# EAGLE design party-games-receiver (EAGLE 7.7.0)
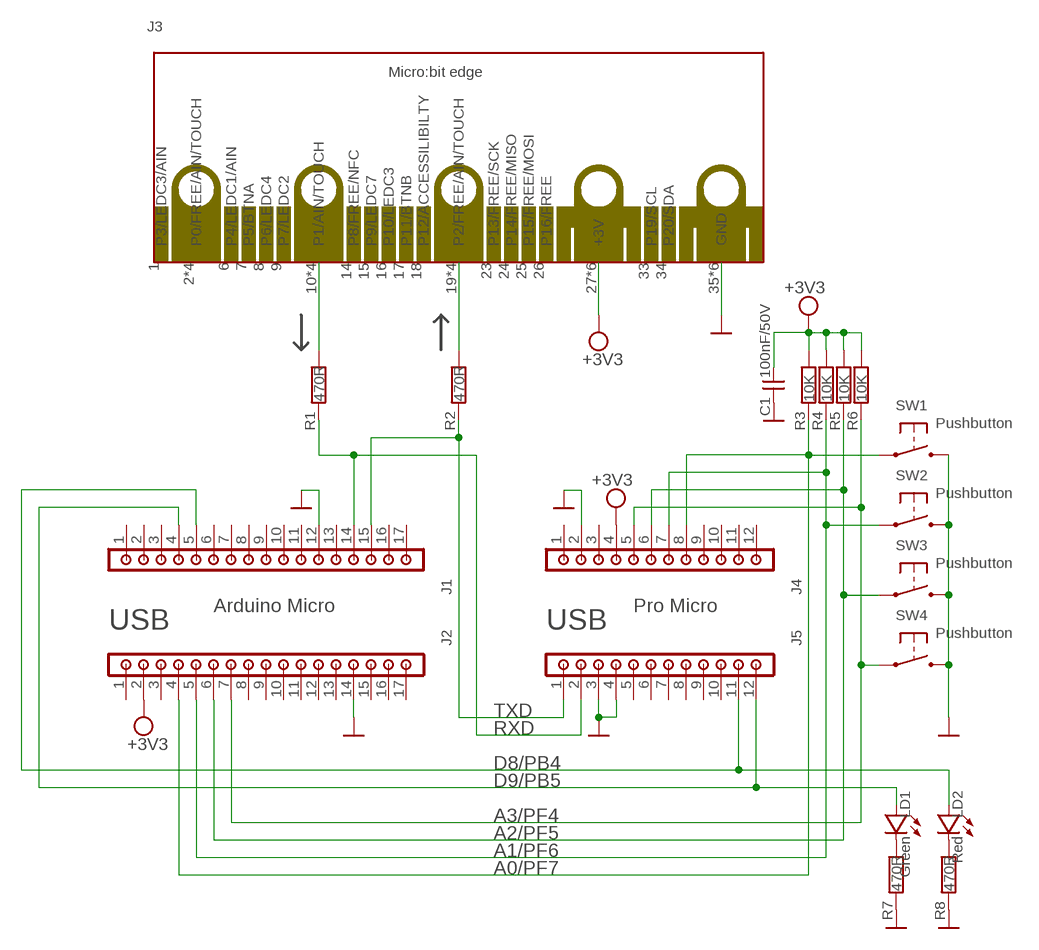
[diagram p0: schematic, sheet 1]

## Parts
C1  CC100NA  [CAP_0805]
J1  CJHDR1X17MA  [CON_HDR_M_1X17]
J2  CJHDR1X17MA  [CON_HDR_M_1X17]
J3  CJMBITH  [SOCKET_MBIT_H]
J4  CJHDR1X12MA  [CON_HDR_M_1X12]
J5  CJHDR1X12MA  [CON_HDR_M_1X12]
LD1  CDLEDGNC  [LED_0805]
LD2  CDLEDRDC  [LED_0805]
R1  CR470RA  [RES_0805]
R2  CR470RA  [RES_0805]
R3  CR10KA  [RES_0805]
R4  CR10KA  [RES_0805]
R5  CR10KA  [RES_0805]
R6  CR10KA  [RES_0805]
R7  CR470RA  [RES_0805]
R8  CR470RA  [RES_0805]
SW1  CSWPUSHA  [SWITCH_PUSH_5MM]
SW2  CSWPUSHA  [SWITCH_PUSH_5MM]
SW3  CSWPUSHA  [SWITCH_PUSH_5MM]
SW4  CSWPUSHA  [SWITCH_PUSH_5MM]

## Nets
+3V3: C1.2 J2.2 J3.27(+3V) J3.28(+3V) J3.29(+3V) J3.30(+3V) J3.31(+3V) J3.32(+3V) J4.4 R3.2 R4.2 R5.2 R6.2 ; supply symbol labelled SUPPLY_+3V3
A0/PF7: J2.4 J4.8 R3.1 SW1.3(P) SW1.4(P)
A1/PF6: J2.5 J4.7 R4.1 SW2.3(P) SW2.4(P)
A2/PF5: J2.6 J4.6 R5.1 SW3.3(P) SW3.4(P)
A3/PF4: J2.7 J4.5 R6.1 SW4.3(P) SW4.4(P)
D8/PB4: J1.5 J5.11 LD2.A
D9/PB5: J1.4 J5.12 LD1.A
GND: C1.1 J1.12 J2.14 J3.35(GND) J3.36(GND) J3.37(GND) J3.38(GND) J3.39(GND) J3.40(GND) J4.2 J5.3 J5.4 R7.1 R8.1 SW1.1(S) SW1.2(S) SW2.1(S) SW2.2(S) SW3.1(S) SW3.2(S) SW4.1(S) SW4.2(S)
N$1: LD1.C R7.2
N$2: J3.10(P1/AIN/TOUCH) J3.11(P1/AIN/TOUCH) J3.12(P1/AIN/TOUCH) J3.13(P1/AIN/TOUCH) R1.2
N$3: J3.19(P2/FREE/AIN/TOUCH) J3.20(P2/FREE/AIN/TOUCH) J3.21(P2/FREE/AIN/TOUCH) J3.22(P2/FREE/AIN/TOUCH) R2.2
N$4: LD2.C R8.2
RXD: J1.14 J5.2 R1.1
TXD: J1.15 J5.1 R2.1
Unconnected: J1.1 J1.2 J1.3 J1.6 J1.7 J1.8 J1.9 J1.10 J1.11 J1.13 J1.16 J1.17 J2.1 J2.3 J2.8 J2.9 J2.10 J2.11 J2.12 J2.13 J2.15 J2.16 J2.17 J3.1(P3/LEDC3/AIN) J3.2(P0/FREE/AIN/TOUCH) J3.3(P0/FREE/AIN/TOUCH) J3.4(P0/FREE/AIN/TOUCH) J3.5(P0/FREE/AIN/TOUCH) J3.6(P4/LEDC1/AIN) J3.7(P5/BTNA) J3.8(P6/LEDC4) J3.9(P7/LEDC2) J3.14(P8/FREE/NFC) J3.15(P9/LEDC7) J3.16(P10/LEDC3) J3.17(P11/BTNB) J3.18(P12/ACCESSILIBILTY) J3.23(P13/FREE/SCK) J3.24(P14/FREE/MISO) J3.25(P15/FREE/MOSI) J3.26(P16/FREE) J3.33(P19/SCL) J3.34(P20/SDA) J4.1 J4.3 J4.9 J4.10 J4.11 J4.12 J5.5 J5.6 J5.7 J5.8 J5.9 J5.10

## Notes on the sheet
- Arduino Micro | Pro Micro
- USB | USB

## Library data of the parts
C1 = d2s_new:CC100NA: Capacitor ceramic 100nF / 50V / SMD 0805 / X7R Estimated price: 0.006000 EUR; ESTIMATED_PRICE: 0.006000; SUPPLIER_1: Farnell; SUPPLIER_1_REF: 1759265; VALUE_SHOWN: 100nF/50V
J1 J2 = d2s_new:CJHDR1X17MA
J3 = d2s_new:CJMBITH: Micro:bit edge connectie Estimated price: 0.000000 EUR; ESTIMATED_PRICE: 0.000000; VALUE_SHOWN: Micro:bit edge
J4 J5 = d2s_new:CJHDR1X12MA
LD1 = d2s_new:CDLEDGNC: Led Green 568nm / 120 deg / 20mA / 2,2V / SMD 0805 Estimated price: 0.080000 EUR; ESTIMATED_PRICE: 0.080000; SUPPLIER_1: Farnell; SUPPLIER_1_REF: 2099239; VALUE_SHOWN: Green
LD2 = d2s_new:CDLEDRDC: Led Red 625nm / 120 deg / 20mA / 2V / SMD 0805 Estimated price: 0.017800 EUR; ESTIMATED_PRICE: 0.017800; SUPPLIER_1: Farnell; SUPPLIER_1_REF: 2099236; VALUE_SHOWN: Red
R1 R2 R7 R8 = d2s_new:CR470RA: 470R / 1% / 0,1W / 0805 Estimated price: 0.001400 EUR; ESTIMATED_PRICE: 0.001400; SUPPLIER_1: Farnell; SUPPLIER_1_REF: 9333258; VALUE_SHOWN: 470R
R3-R6 = d2s_new:CR10KA: 10K / 1% / 0,1W / 0805 Estimated price: 0.001300 EUR; ESTIMATED_PRICE: 0.001300; SUPPLIER_1: Farnell; SUPPLIER_1_REF: 9332391; VALUE_SHOWN: 10K
SW1-SW4 = d2s_new:CSWPUSHA: drukknop (on)-off 6x6mm print height 4mm Estimated price: 0.268000 EUR; ESTIMATED_PRICE: 0.268000; SUPPLIER_1: Vael; SUPPLIER_1_REF: 760.41606.5; VALUE_SHOWN: Pushbutton

## Board
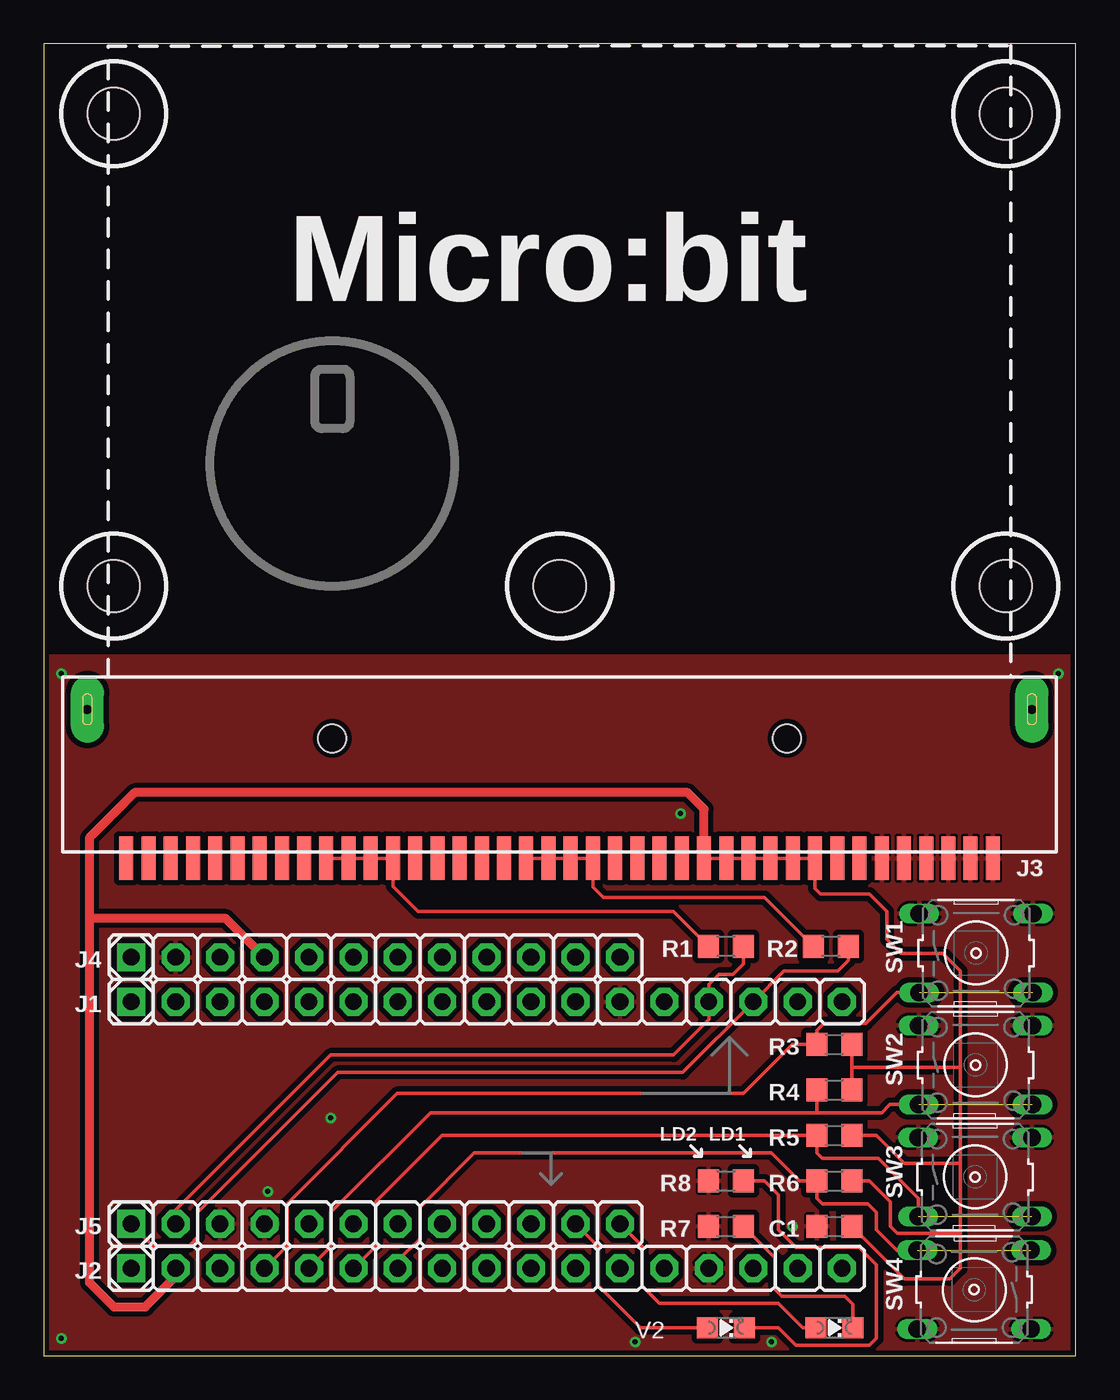
[diagram p1: board, top side]
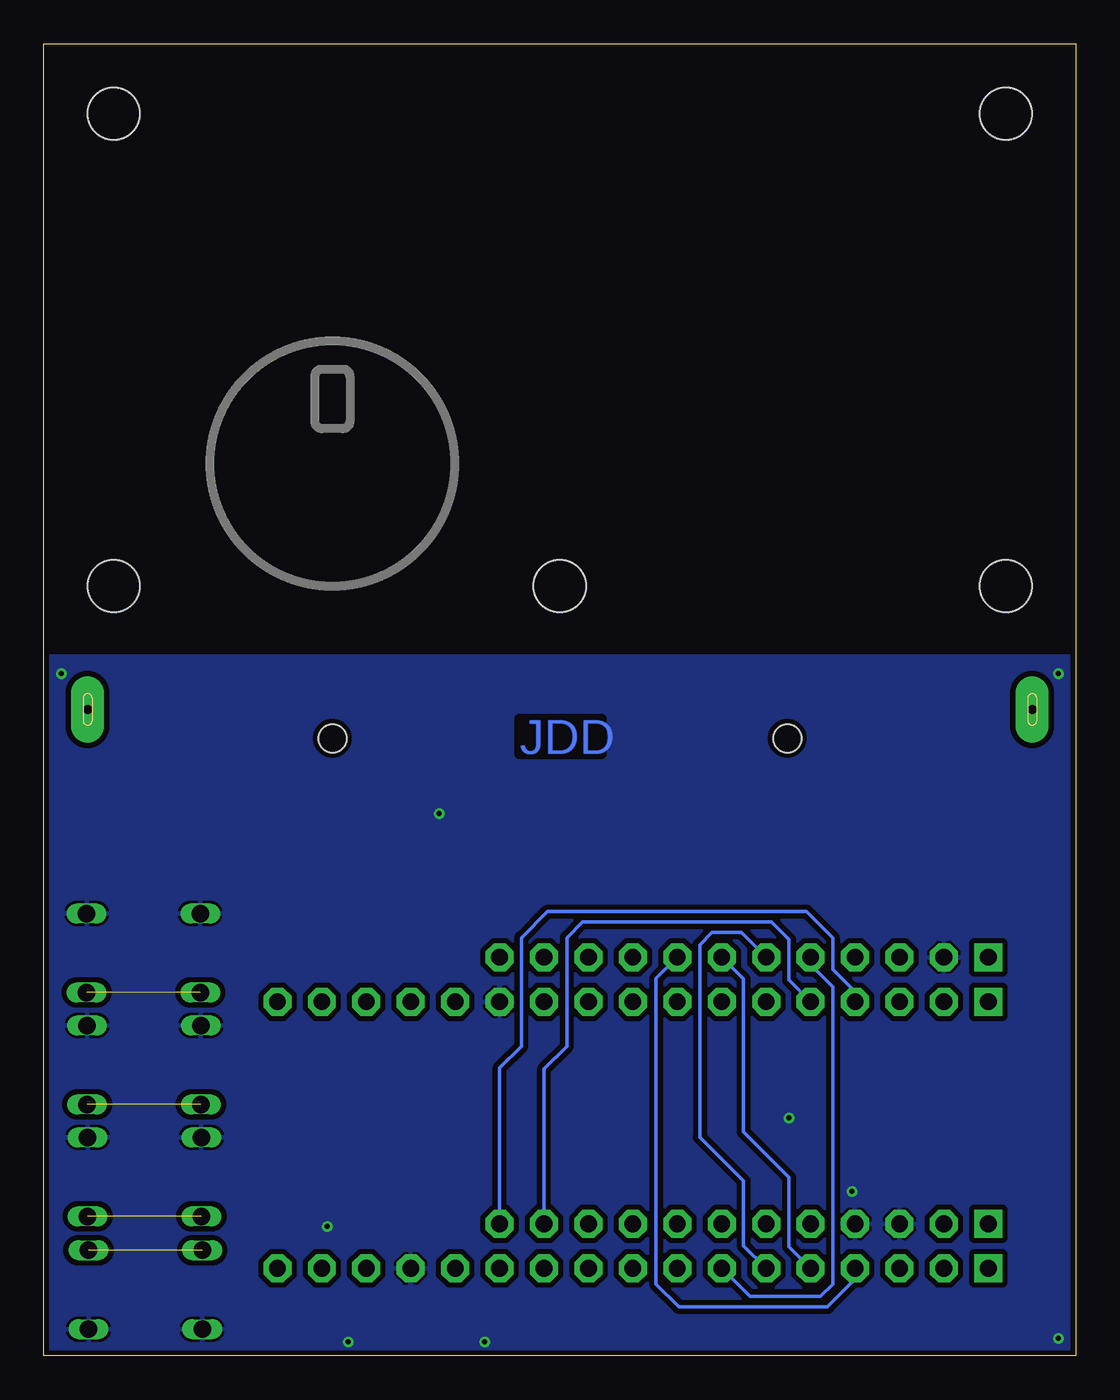
[diagram p2: board, bottom side, seen from below]

Size 59 x 75 mm. Coordinates in mm from the lower left corner, seen from the top.
Outline: 0,0 59,0 59,75 0,75 0,0
Copper layers (1*16): Top 0.035mm / dielectric 1.55mm / Bottom 0.035mm
Design rules "JLC 2 layer standard": minimum track width 5mil, minimum drill 0.3mm, track to track 5mil, track to pad 5mil, pad to pad 5mil, via to via 5mil, smd to smd 5mil, copper to edge 0.3mm, drill to drill 0.3mm, minimum pad ring 3mil, minimum via ring 3mil, stop-mask expansion 0.1mm, vias tented up to drill 0.5mm, thermal gap 0.15mm

### Footprints (pad centres in the part's own frame; a part is rotated, then mirrored left to right if it is on the bottom)
CAP_0805 = smd 1.2 x 1.3: 1 -1,0; 2 1,0
CON_HDR_M_1X17 = drill 0.95 pad 1.6 square: 1 0,0 | drill 0.95 pad 1.6 octagon: 2 0,-2.54; 3 0,-5.08; 4 0,-7.62; 5 0,-10.16; 6 0,-12.7; 7 0,-15.24; 8 0,-17.78; 9 0,-20.32; 10 0,-22.86; 11 0,-25.4; 12 0,-27.94; 13 0,-30.48; 14 0,-33.02; 15 0,-35.56; 16 0,-38.1; 17 0,-40.64
SOCKET_MBIT_H = smd 0.8 x 2.5: 1 -24.765,-6.85; 2 -23.495,-6.85; 3 -22.225,-6.85; 4 -20.955,-6.85; 5 -19.685,-6.85; 6 -18.415,-6.85; 7 -17.145,-6.85; 8 -15.875,-6.85; 9 -14.605,-6.85; 10 -13.335,-6.85; 11 -12.065,-6.85; 12 -10.795,-6.85; 13 -9.525,-6.85; 14 -8.255,-6.85; 15 -6.985,-6.85; 16 -5.715,-6.85; 17 -4.445,-6.85; 18 -3.175,-6.85; 19 -1.905,-6.85; 20 -0.635,-6.85; 21 0.635,-6.85; 22 1.905,-6.85; 23 3.175,-6.85; 24 4.445,-6.85; 25 5.715,-6.85; 26 6.985,-6.85; 27 8.255,-6.85; 28 9.525,-6.85; 29 10.795,-6.85; 30 12.065,-6.85; 31 13.335,-6.85; 32 14.605,-6.85; 33 15.875,-6.85; 34 17.145,-6.85; 35 18.415,-6.85; 36 19.685,-6.85; 37 20.955,-6.85; 38 22.225,-6.85; 39 23.495,-6.85; 40 24.765,-6.85 | drill 0.5 pad 1.9 long: P$1 27,1.66; P$2 -27,1.66 | hole 1.6: -13,0; 13,0
CON_HDR_M_1X12 = drill 0.95 pad 1.6 square: 1 0,0 | drill 0.95 pad 1.6 octagon: 2 0,-2.54; 3 0,-5.08; 4 0,-7.62; 5 0,-10.16; 6 0,-12.7; 7 0,-15.24; 8 0,-17.78; 9 0,-20.32; 10 0,-22.86; 11 0,-25.4; 12 0,-27.94
LED_0805 = smd 1.2 x 1.2: A -1.05,0; C 1.05,0
RES_0805 = smd 1.2 x 1.3: 1 -1,0; 2 1,0
SWITCH_PUSH_5MM = drill 1 long: 1 -3.251,2.261; 2 3.251,2.261; 3 -3.251,-2.261; 4 3.251,-2.261
HOLE_3MM_ISOLATED = hole 3: 0,0

### Placement (x,y rotation side)
C1  45.2,7.4 0 top
J1  5,20.24 90 top
J2  5,5 90 top
J3  29.49,35.29 0 top
J4  5,22.78 90 top
J5  5,7.54 90 top
LD1  45.2,1.6 0 top
LD2  39,1.6 0 top
R1  39,23.4 180 top
R2  45,23.4 180 top
R3  45.2,17.8 0 top
R4  45.2,15.2 0 top
R5  45.2,12.6 0 top
R6  45.2,10 0 top
R7  39,7.4 0 top
R8  39,10 0 top
SW1  53.3,23.02 0 top
SW2  53.27,16.62 0 top
SW3  53.24,10.22 0 top
SW4  53.19,3.78 180 top
U$5  [HOLE_3MM_ISOLATED]  55,71 0 top
U$6  [HOLE_3MM_ISOLATED]  4,71 0 top
U$7  [HOLE_3MM_ISOLATED]  55,44 0 top
U$8  [HOLE_3MM_ISOLATED]  4,44 0 top
U$9  [HOLE_3MM_ISOLATED]  29.5,44 0 top

### Tracks (layer width: path | path; a pad name or v marks a point on that pad's centre or on a via)
+3V3
  Top 0.2: J3.27 J3.28 J3.29 J3.30 J3.31 J3.32 44.09,26.7 44.4,26.4 47.2,26.4 48.2,25.4 48.2,23.8 49,23 51.4,23 52.4,22 52.4,16.5 | 52.4,16.5 52.4,11 | 52.4,11 52.4,7 | 52.4,7 52.4,5 51.8,4.4 49.2,4.4 C1.2 | R3.2 46.2,16.5 | 46.2,16.5 52.4,16.5 | R4.2 46.2,16.5 | R5.2 47.6,12.6 49.2,11 52.4,11 | R6.2 47.2,10 48.4,8.8 48.4,7.4 48.8,7 52.4,7
  Top 0.5: J3.27 37.74,31.25 36.8,32.2 5.2,32.2 2.6,29.6 2.6,25 | 2.6,25 2.6,4.2 4,2.8 5.8,2.8 7.54,4.54 J2.2 | J4.4 10.4,25 2.6,25
A0/PF7  (1 unrouted)
  Top 0.2: SW1.3 48.76,20.76 47,19 44.6,19 44.2,18.6 R3.1 42.8,17.8 40,15 20.2,15 13.9,8.7 13.9,6.28 J2.4
  Bottom 0.2: J4.8 24,21.56 24,4.1 22.7,2.8 14.2,2.8 12.62,4.38 J2.4
A1/PF6  (1 unrouted)
  Top 0.2: SW2.3 48.36,14.36 47.9,13.9 44.2,13.9 | 44.2,13.9 22.1,13.9 16.4,8.2 16.4,6.24 J2.5 | R4.1 44.2,13.9
  Bottom 0.2: J4.7 19,21.54 19,12.8 16.4,10.2 16.4,6.24 J2.5
A2/PF5  (1 unrouted)
  Top 0.2: SW3.3 49.99,9.01 47.7,11.3 44.5,11.3 44.2,11.6 R5.1 22.76,12.6 19,8.84 19,6.3 J2.6
  Bottom 0.2: J4.6 19.12,24.2 20.8,24.2 21.5,23.5 21.5,12.5 19,10 19,6.3 J2.6
A3/PF4  (1 unrouted)
  Top 0.2: SW4.4 48.76,6.04 47.6,7.2 47.6,8.2 47.1,8.7 44.5,8.7 44.2,9 R6.1 43.2,10 41.6,11.6 24.6,11.6 21.5,8.5 21.5,6.7 20.24,5.44 J2.7
  Bottom 0.2: J4.5 15.16,22.36 13.9,21.1 13.9,4.1 14.6,3.4 18.64,3.4 J2.7
D8/PB4
  Top 0.2: LD2.A 34.1,1.6 31.7,4 31.7,6.24 J5.11
  Bottom 0.2: J5.11 30.4,16.4 29.1,17.7 29.1,23.9 28.2,24.8 17.4,24.8 16.4,23.8 16.4,21.48 J1.5
D9/PB5
  Top 0.2: LD1.A 43.4,1.6 42,3 35.2,3 34.2,4 34.2,6.28 J5.12
  Bottom 0.2: J5.12 32.94,16.46 31.7,17.7 31.7,23.9 30.2,25.4 15.4,25.4 13.9,23.9 13.9,22.1 12.62,20.82 J1.4
GND  (via drill 0.3 pad 0.6)
  other vias: 36.4,31 1,1 58,39 1,39 42.8,7.4 12.8,9.4 16.4,13.6 41.6,0.8 33.8,0.8
  pour Bottom (isolate 0.3): 0,0 0,40 59,40 59,0
  pour Top (isolate 0.3): 0,0 0,40 59,40 59,0
N$1
  Top 0.2: R7.2 41.8,5.6 41.8,3.8 42.2,3.4 45.8,3.4 46.25,2.95 LD1.C
N$2
  Top 0.2: J3.10 J3.11 J3.12 J3.13 19.96,26.84 21.4,25.4 36,25.4 R1.2
N$3
  Top 0.2: J3.19 J3.20 J3.21 J3.22 31.39,26.8 32,26.2 41.2,26.2 R2.2
N$4
  Top 0.2: LD2.C 42,1.6 43,0.6 47.2,0.6 47.6,1 47.6,5.2 46.6,6.2 43,6.2 42,7.2 42,9.2 41.2,10 R8.2
RXD
  Top 0.2: J5.2 7.54,8.34 16.4,17.2 36,17.2 38.02,19.22 J1.14 38.02,21.22 38.6,21.8 39.4,21.8 40,22.4 R1.1
TXD
  Top 0.2: 46,23.6 R2.1 46,22.6 45.4,22 42.32,22 J1.15 36.52,16.2 16.8,16.2 8.8,8.2 8.8,6.8 8.3,6.3 6.24,6.3 J5.1

### Text on the board
Bottom: JDD
tNames: V2
tDocu: CoderDojo / St-Niklaas | 1: Key A 2: 30 Key/s 3: 300 Key/s 4: Pause | 1 | 2 | Arduino Micro | USB | Pro Micro | 3 | 4 | Pause | Tx | Micro:bit to PC bridge
bDocu: CoderDojo / St-Niklaas